# Altium project BetterFC.PrjPcb
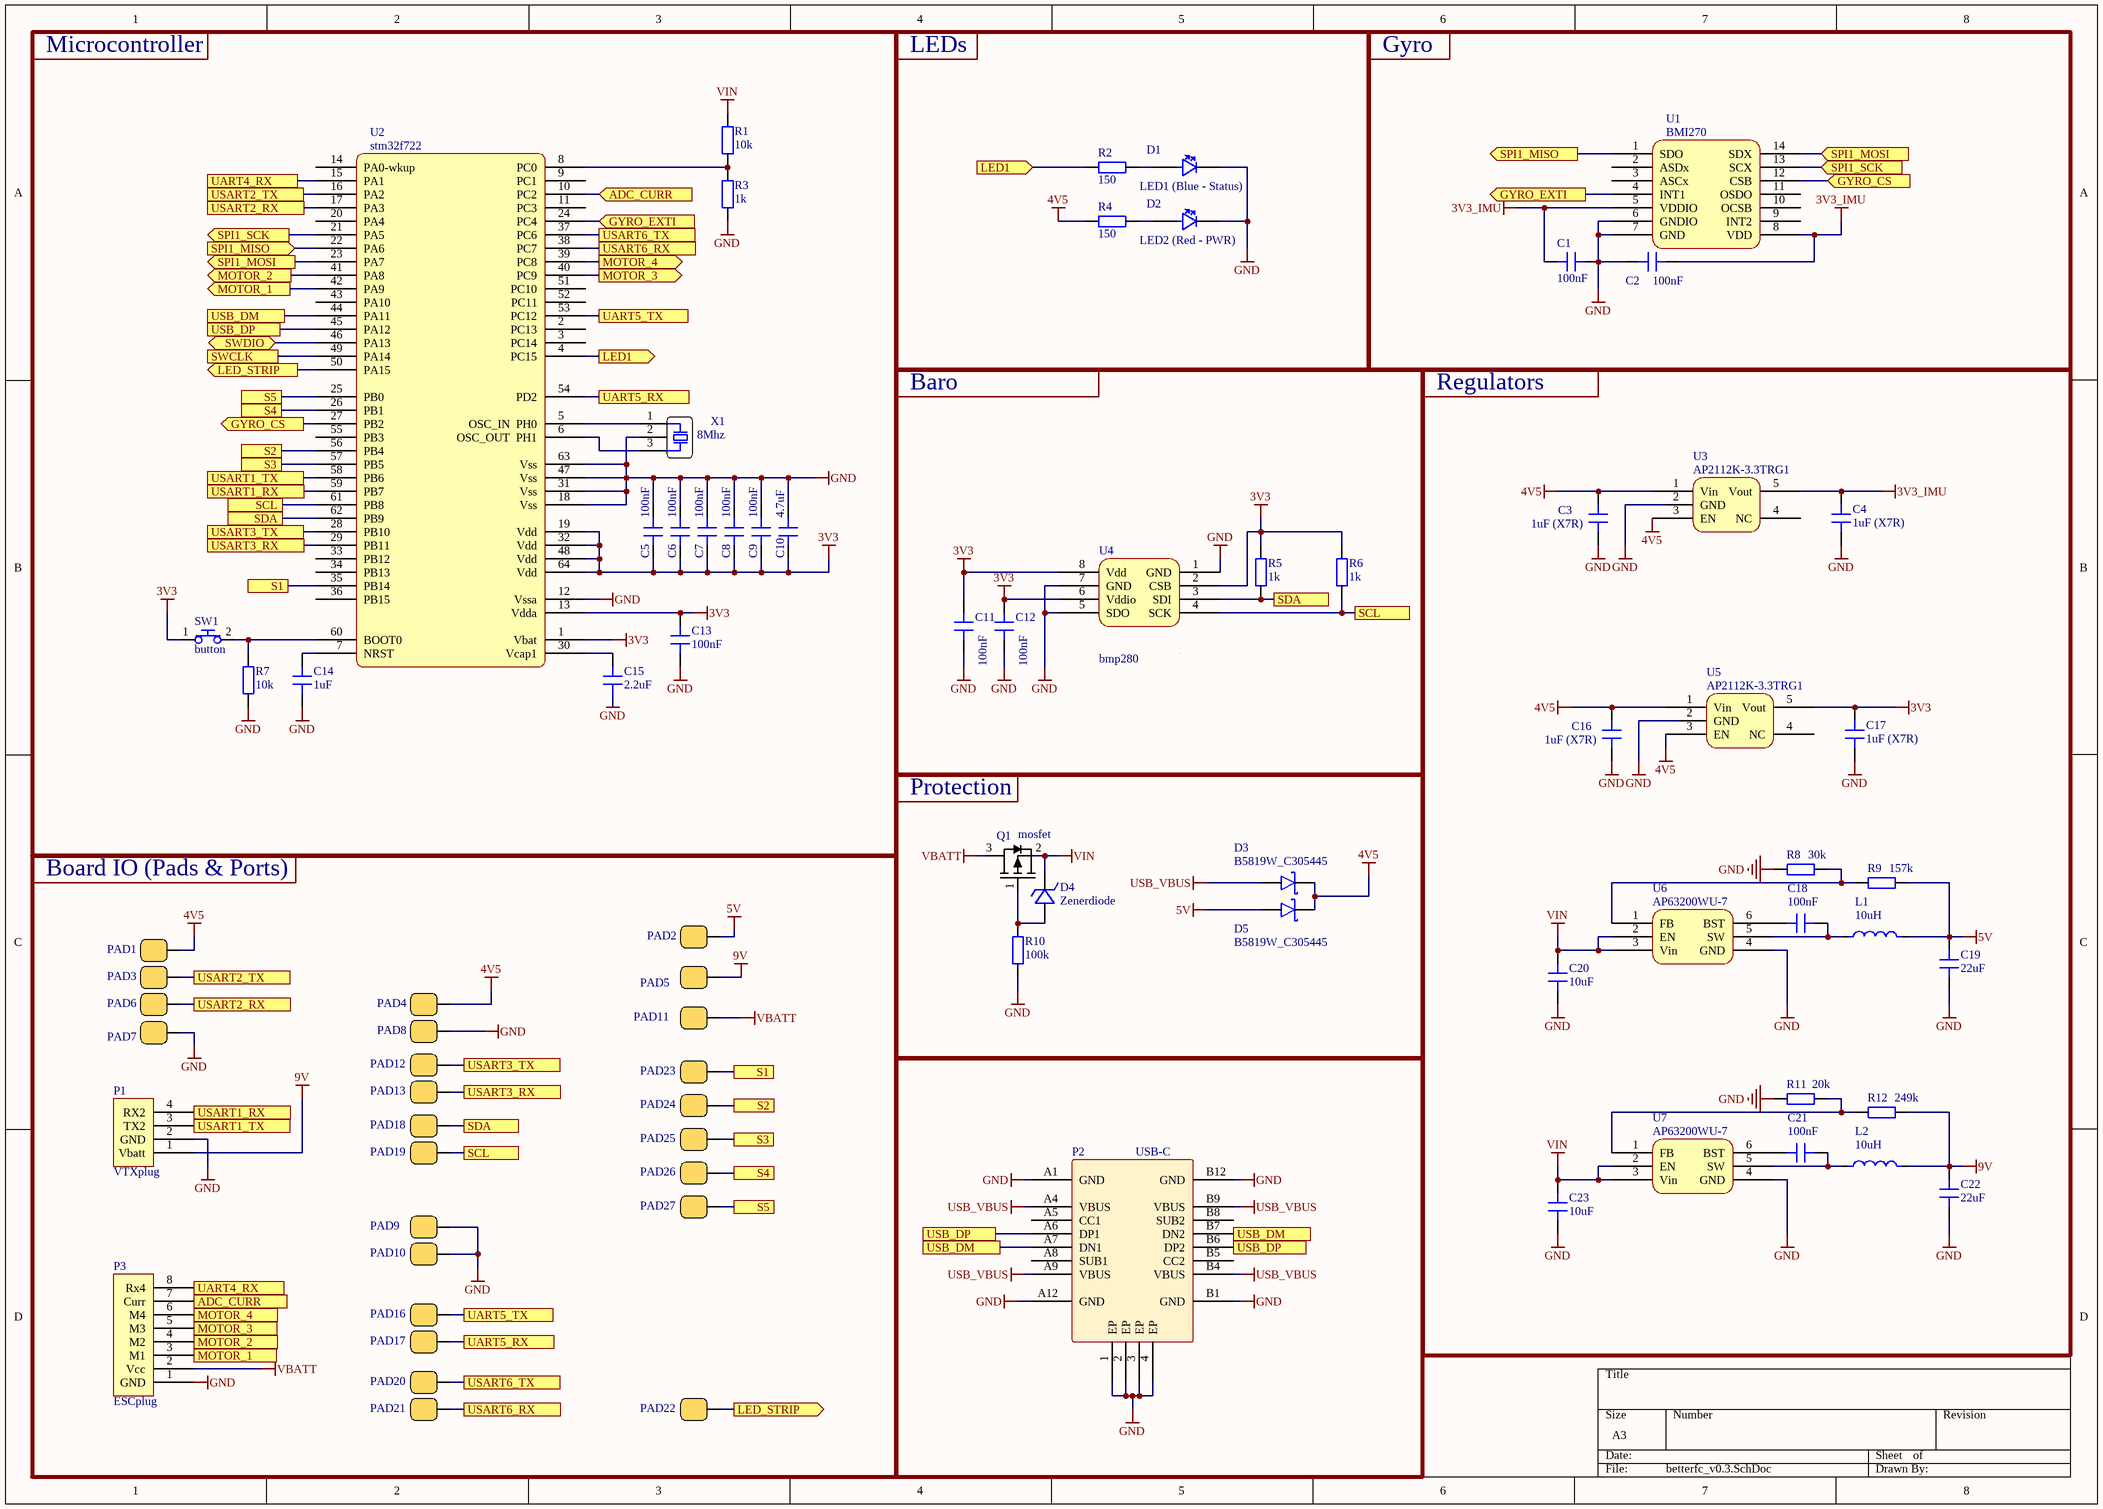
[diagram p0: betterfc_v0.3.SchDoc]
1 sheet, 80 parts. Net scope: flat (ports and power ports of the same name join across sheets).
Board files: betterfc_v0.3.PcbDoc, betterfc_v0.2.PcbDoc

## Sheet betterfc_v0.3.SchDoc: BetterFC
size A3; DrawnBy: Isaak & Maarten; Revision: V0.1; SheetNumber: 1; SheetTotal: 1

### Parts
C1  100nF  [0402_CAP]
C2  100nF  [0402_CAP]
C3  1uF (X7R)  [0603_CAP]
C4  1uF (X7R)  [0603_CAP]
C5  100nF  [0402_CAP]
C6  100nF  [0402_CAP]
C7  100nF  [0402_CAP]
C8  100nF  [0402_CAP]
C9  100nF  [0402_CAP]
C10  4.7uF  [0603_CAP]
C11  100nF  [0402_CAP]
C12  100nF  [0402_CAP]
C13  100nF  [0402_CAP]
C14  1uF  [0603_CAP]
C15  2.2uF  [0603_CAP]
C16  1uF (X7R)  [0603_CAP]
C17  1uF (X7R)  [0603_CAP]
C18  100nF  [0402_CAP]
C19  22uF  [0603_CAP]
C20  10uF  [0603_CAP]
C21  100nF  [0402_CAP]
C22  22uF  [0603_CAP]
C23  10uF  [0603_CAP]
D1  LED1 (Blue - Status)  [0402_LED]
D2  LED2 (Red - PWR)  [0402_LED]
D3  B5819W_C305445  [scottydiode]
D4  Zenerdiode  [Zenerdiode]
D5  B5819W_C305445  [scottydiode]
L1  10uH  [coil]
L2  10uH  [coil]
P1  VTXplug  [VTXplug]
P2  USB-C  [USB-C_1]
P3  ESCplug  [ESCplug]
PAD1  BTR_PAD  [PAD_1_1.25]  (value not drawn)
PAD2  BTR_PAD  [PAD_1_1.25]  (value not drawn)
PAD3  BTR_PAD  [PAD_1_1.25]  (value not drawn)
PAD4  BTR_PAD  [PAD_1_1.25]  (value not drawn)
PAD5  BTR_PAD  [PAD_1_1.25]  (value not drawn)
PAD6  BTR_PAD  [PAD_1_1.25]  (value not drawn)
PAD7  BTR_PAD  [PAD_1_1.25]  (value not drawn)
PAD8  BTR_PAD  [PAD_1_1.25]  (value not drawn)
PAD9  BTR_PAD  [PAD_1_1.25]  (value not drawn)
PAD10  BTR_PAD  [PAD_1_1.25]  (value not drawn)
PAD11  BTR_PAD  [PAD_1_1.25]  (value not drawn)
PAD12  BTR_PAD  [PAD_1_1.25]  (value not drawn)
PAD13  BTR_PAD  [PAD_1_1.25]  (value not drawn)
PAD16  BTR_PAD  [PAD_0.7_0.95]  (value not drawn)
PAD17  BTR_PAD  [PAD_0.7_0.95]  (value not drawn)
PAD18  BTR_PAD  [PAD_1_1.25]  (value not drawn)
PAD19  BTR_PAD  [PAD_1_1.25]  (value not drawn)
PAD20  BTR_PAD  [PAD_0.7_0.95]  (value not drawn)
PAD21  BTR_PAD  [PAD_0.7_0.95]  (value not drawn)
PAD22  BTR_PAD  [PAD_1_1.25]  (value not drawn)
PAD23  BTR_PAD  [PAD_1_1.25]  (value not drawn)
PAD24  BTR_PAD  [PAD_1_1.25]  (value not drawn)
PAD25  BTR_PAD  [PAD_1_1.25]  (value not drawn)
PAD26  BTR_PAD  [PAD_1_1.25]  (value not drawn)
PAD27  BTR_PAD  [PAD_1_1.25]  (value not drawn)
Q1  mosfet  [mosfet]
R1  10k  [0402_RES]
R2  150  [0402_RES]
R3  1k  [0402_RES]
R4  150  [0402_RES]
R5  1k  [0402_RES]
R6  1k  [0402_RES]
R7  10k  [0402_RES]
R8  30k  [0402_RES]
R9  157k  [0402_RES]
R10  100k  [0402_RES]
R11  20k  [0402_RES]
R12  249k  [0402_RES]
SW1  button  [button]
U1  BMI270  [bmi270]
U2  stm32f722  [STM32F722RET6]
U3  AP2112K-3.3TRG1  [LDO]
U4  bmp280  [bmp280]
U5  AP2112K-3.3TRG1  [LDO]
U6  AP63200WU-7  [AP63205WU-7]
U7  AP63200WU-7  [AP63205WU-7]
X1  8Mhz  [crystal]

### Blocks framed on the sheet
Microcontroller: C5-C10 C13-C15 R1 R3 R7 SW1 U2 X1
LEDs: D1 D2 R2 R4
Gyro: C1 C2 U1
Baro: C11 C12 R5 R6 U4
Regulators: C3 C4 C16-C23 L1 L2 R8 R9 R11 R12 U3 U5-U7
Protection: D3-D5 Q1 R10
Board IO (Pads & Ports): P1 P3 PAD1-PAD13 PAD16-PAD27

### Ports
ADC_CURR (in, see betterfc_v0.3[1D]), ADC_CURR (out, see betterfc_v0.3[3A]), GYRO_CS (in, see betterfc_v0.3[1B]), GYRO_CS (out, see betterfc_v0.3[7A]), GYRO_EXTI (in, see betterfc_v0.3[6A]), GYRO_EXTI (out, see betterfc_v0.3[3A]), LED1 (in, see betterfc_v0.3[3A]), LED1 (out, see betterfc_v0.3[4A]), LED_STRIP (out, see betterfc_v0.3[1A]), LED_STRIP (out, see betterfc_v0.3[3D]), MOTOR_1 (out, see betterfc_v0.3[1A]), MOTOR_1 (out, see betterfc_v0.3[1D]), MOTOR_2 (out, see betterfc_v0.3[1A]), MOTOR_2 (out, see betterfc_v0.3[1D]), MOTOR_3 (out, see betterfc_v0.3[1D]), MOTOR_3 (out, see betterfc_v0.3[3A]), MOTOR_4 (out, see betterfc_v0.3[1D]), MOTOR_4 (out, see betterfc_v0.3[3A]), S1 (see betterfc_v0.3[1B]), S1 (see betterfc_v0.3[3C]), S2 (see betterfc_v0.3[1B]), S2 (see betterfc_v0.3[3C]), S3 (see betterfc_v0.3[1B]), S3 (see betterfc_v0.3[3D]), S4 (see betterfc_v0.3[1B]), S4 (see betterfc_v0.3[3D]), S5 (see betterfc_v0.3[1B]), S5 (see betterfc_v0.3[3D]), SCL (see betterfc_v0.3[1B], betterfc_v0.3[2D]), SCL (see betterfc_v0.3[1B], betterfc_v0.3[6B]), SCL (see betterfc_v0.3[2D], betterfc_v0.3[6B]), SDA (see betterfc_v0.3[1B], betterfc_v0.3[2C]), SDA (see betterfc_v0.3[1B], betterfc_v0.3[5B]), SDA (see betterfc_v0.3[2C], betterfc_v0.3[5B]), SPI1_MISO (in, see betterfc_v0.3[6A]), SPI1_MISO (out, see betterfc_v0.3[1A]), SPI1_MOSI (in, see betterfc_v0.3[1A]), SPI1_MOSI (out, see betterfc_v0.3[7A]), SPI1_SCK (in, see betterfc_v0.3[1A]), SPI1_SCK (out, see betterfc_v0.3[7A]), SWCLK, SWDIO (bidir), UART4_RX (see betterfc_v0.3[1A]), UART4_RX (see betterfc_v0.3[1D]), UART5_RX (see betterfc_v0.3[2D]), UART5_RX (see betterfc_v0.3[3B]), UART5_TX (see betterfc_v0.3[2D]), UART5_TX (see betterfc_v0.3[3A]), USART1_RX (see betterfc_v0.3[1B]), USART1_RX (see betterfc_v0.3[1C]), USART1_TX (see betterfc_v0.3[1B]), USART1_TX (see betterfc_v0.3[1C]), USART2_RX (see betterfc_v0.3[1A]), USART2_RX (see betterfc_v0.3[1C]), USART2_TX (see betterfc_v0.3[1A]), USART2_TX (see betterfc_v0.3[1C]), USART3_RX (see betterfc_v0.3[1B]), USART3_RX (see betterfc_v0.3[2C]), USART3_TX (see betterfc_v0.3[1B]), USART3_TX (see betterfc_v0.3[2C]), USART6_RX (see betterfc_v0.3[2D]), USART6_RX (see betterfc_v0.3[3A]), USART6_TX (see betterfc_v0.3[2D]), USART6_TX (see betterfc_v0.3[3A]), USB_DM (see betterfc_v0.3[1A], betterfc_v0.3[4D]), USB_DM (see betterfc_v0.3[1A], betterfc_v0.3[5D]), USB_DM (see betterfc_v0.3[4D], betterfc_v0.3[5D]), USB_DP (see betterfc_v0.3[1A], betterfc_v0.3[4D]), USB_DP (see betterfc_v0.3[1A], betterfc_v0.3[5D]), USB_DP (see betterfc_v0.3[4D], betterfc_v0.3[5D])

### Nets
3V3: C5.1 C6.1 C7.1 C8.1 C9.1 C10.1 C11.2 C12.1 C13.2 C17.2 R5.2 R6.2 SW1.1 U2.1(Vbat) U2.13(Vdda) U2.19(Vdd) U2.32(Vdd) U2.48(Vdd) U2.64(Vdd) U4.2(CSB) U4.6(Vddio) U4.8(Vdd) U5.5(Vout)
3V3_IMU: C1.1 C2.2 C4.2 U1.5(VDDIO) U1.8(VDD) U3.5(Vout)
4V5: C3.2 C16.2 D3.2 D5.2 PAD1.1 PAD4.1 R4.1 U3.1(Vin) U3.3(EN) U5.1(Vin) U5.3(EN)
5V: C19.2 D5.1 L1.2 PAD2.1 R9.2
9V: C22.2 L2.2 P1.1(Vbatt) PAD5.1 R12.2
GND: C1.2 C2.1 C3.1 C4.1 C5.2 C6.2 C7.2 C8.2 C9.2 C10.2 C11.1 C12.2 C13.1 C14.1 C15.1 C16.1 C17.1 C19.1 C20.1 C22.1 C23.1 D1.2(+) D2.2(+) P1.2(GND) P2.1(EP) P2.2(EP) P2.3(EP) P2.4(EP) P2.A1(GND) P2.A12(GND) P2.B1(GND) P2.B12(GND) P3.1(GND) PAD7.1 PAD8.1 PAD9.1 PAD10.1 R3.1 R7.1 R8.2 R10.1 R11.2 U1.6(GNDIO) U1.7(GND) U2.12(Vssa) U2.18(Vss) U2.31(Vss) U2.47(Vss) U2.63(Vss) U3.2(GND) U4.1(GND) U4.5(SDO) U4.7(GND) U5.2(GND) U6.4(GND) U7.4(GND) X1.2
USB_VBUS: D3.1 P2.A4(VBUS) P2.A9(VBUS) P2.B4(VBUS) P2.B9(VBUS)
VBATT: P3.2(Vcc) PAD11.1 Q1.3
VIN: C20.2 C23.2 D4.2 Q1.2 R1.2 U6.2(EN) U6.3(Vin) U7.2(EN) U7.3(Vin)
NetC14_2: C14.2 U2.7(NRST)
NetC15_2: C15.2 U2.30(Vcap1)
NetC18_1: C18.1 L1.1 U6.5(SW)
NetC18_2: C18.2 U6.6(BST)
NetC21_1: C21.1 L2.1 U7.5(SW)
NetC21_2: C21.2 U7.6(BST)
NetD1_1: D1.1 R2.2
NetD2_1: D2.1 R4.2
NetD4_1: D4.1 Q1.1 R10.2
NetP1_3: P1.3(TX2) U2.58(PB6) ; port USART1_TX
NetP1_4: P1.4(RX2) U2.59(PB7) ; port USART1_RX
NetP2_A6: P2.A6(DP1) P2.B6(DP2) U2.45(PA12) ; port USB_DP
NetP2_A7: P2.A7(DN1) P2.B7(DN2) U2.44(PA11) ; port USB_DM
NetP3_3: P3.3(M1) U2.42(PA9) ; port MOTOR_1
NetP3_4: P3.4(M2) U2.41(PA8) ; port MOTOR_2
NetP3_5: P3.5(M3) U2.40(PC9) ; port MOTOR_3
NetP3_6: P3.6(M4) U2.39(PC8) ; port MOTOR_4
NetP3_7: P3.7(Curr) U2.10(PC2) ; port ADC_CURR
NetP3_8: P3.8(Rx4) U2.15(PA1) ; port UART4_RX
NetPAD3_1: PAD3.1 U2.16(PA2) ; port USART2_TX
NetPAD6_1: PAD6.1 U2.17(PA3) ; port USART2_RX
NetPAD12_1: PAD12.1 U2.28(PB10) ; port USART3_TX
NetPAD13_1: PAD13.1 U2.29(PB11) ; port USART3_RX
NetPAD16_1: PAD16.1 U2.53(PC12) ; port UART5_TX
NetPAD17_1: PAD17.1 U2.54(PD2) ; port UART5_RX
NetPAD18_1: PAD18.1 R5.1 U2.62(PB9) U4.3(SDI) ; port SDA
NetPAD19_1: PAD19.1 R6.1 U2.61(PB8) U4.4(SCK) ; port SCL
NetPAD20_1: PAD20.1 U2.37(PC6) ; port USART6_TX
NetPAD21_1: PAD21.1 U2.38(PC7) ; port USART6_RX
NetPAD22_1: PAD22.1 U2.50(PA15) ; port LED_STRIP
NetPAD23_1: PAD23.1 U2.35(PB14) ; port S1
NetPAD24_1: PAD24.1 U2.56(PB4) ; port S2
NetPAD25_1: PAD25.1 U2.57(PB5) ; port S3
NetPAD26_1: PAD26.1 U2.26(PB1) ; port S4
NetPAD27_1: PAD27.1 U2.25(PB0) ; port S5
NetR1_1: R1.1 R3.2 U2.8(PC0)
NetR2_1: R2.1 U2.4(PC15) ; port LED1
NetR7_2: R7.2 SW1.2 U2.60(BOOT0)
NetR8_1: R8.1 R9.1 U6.1(FB)
NetR11_1: R11.1 R12.1 U7.1(FB)
NetU1_1: U1.1(SDO) U2.22(PA6) ; port SPI1_MISO
NetU1_4: U1.4(INT1) U2.24(PC4) ; port GYRO_EXTI
NetU1_12: U1.12(CSB) U2.27(PB2) ; port GYRO_CS
NetU1_13: U1.13(SCX) U2.21(PA5) ; port SPI1_SCK
NetU1_14: U1.14(SDX) U2.23(PA7) ; port SPI1_MOSI
NetU2_5: U2.5(OSC_IN__PH0) X1.1
NetU2_6: U2.6(OSC_OUT__PH1) X1.3
NetU2_46: U2.46(PA13) ; port SWDIO
NetU2_49: U2.49(PA14) ; port SWCLK

Not connected (* = marked no-connect by the designer): P2 A5(CC1) A8(SUB1) B5(CC2) B8(SUB2); U1 2(ASDx) 3(ASCx) 9(INT2) 10(OCSB) 11(OSDO); U2 2(PC13) 3(PC14) 9(PC1) 11(PC3) 14(PA0-wkup) 20(PA4) 33(PB12) 34(PB13) 36(PB15) 43(PA10) 51(PC10) 52(PC11) 55(PB3); U3 4(NC); U5 4(NC)

### Library data of the parts
C1-C23 = C
D1 D2 = LED
D3 D5 = ScottyDiode
L1 L2 = coil
P2 = USB-C_1
R1-R12 = R
U3 U5 = LDO
U6 U7 = AP63205WU-7
X1 = Crystal